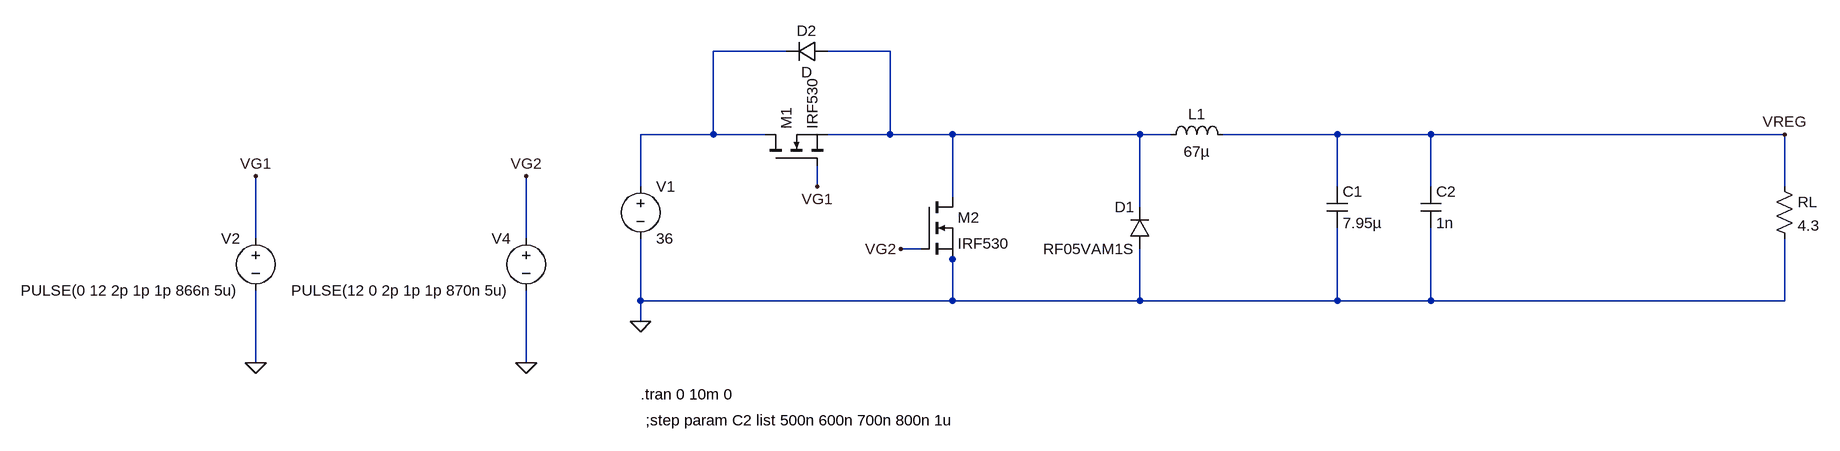
[diagram p0: schematic BUCK_v1.asc]
BUCK_v1.asc, the LTspice schematic file:
Version 4
SHEET 1 1644 692
WIRE 48 -80 -64 -80
WIRE 208 -80 112 -80
WIRE -64 48 -64 -80
WIRE -64 48 -176 48
WIRE 16 48 -64 48
WIRE 208 48 208 -80
WIRE 208 48 112 48
WIRE 304 48 208 48
WIRE 592 48 304 48
WIRE 640 48 592 48
WIRE 896 48 720 48
WIRE 1040 48 896 48
WIRE 1584 48 1040 48
WIRE -176 128 -176 48
WIRE 96 128 96 96
WIRE 896 128 896 48
WIRE 1040 128 1040 48
WIRE 1584 128 1584 48
WIRE 304 144 304 48
WIRE 592 160 592 48
WIRE -768 208 -768 112
WIRE -352 208 -352 112
WIRE 256 224 224 224
WIRE 304 240 304 224
WIRE -176 304 -176 208
WIRE 304 304 304 240
WIRE 304 304 -176 304
WIRE 592 304 592 224
WIRE 592 304 304 304
WIRE 896 304 896 192
WIRE 896 304 592 304
WIRE 1040 304 1040 192
WIRE 1040 304 896 304
WIRE 1584 304 1584 208
WIRE 1584 304 1040 304
WIRE -176 336 -176 304
WIRE -768 400 -768 288
WIRE -352 400 -352 288
FLAG -768 400 0
FLAG -176 336 0
FLAG -768 112 VG1
FLAG 96 128 VG1
FLAG 1584 48 VREG
FLAG -352 112 VG2
FLAG -352 400 0
FLAG 224 224 VG2
SYMBOL voltage -176 112 R0
WINDOW 123 0 0 Left 0
WINDOW 39 0 0 Left 0
SYMATTR InstName V1
SYMATTR Value 36
SYMBOL ind 624 64 R270
WINDOW 0 32 56 VTop 2
WINDOW 3 5 56 VBottom 2
SYMATTR InstName L1
SYMATTR Value 67µ
SYMBOL cap 880 128 R0
SYMATTR InstName C1
SYMATTR Value 7.95µ
SYMBOL nmos 16 96 R270
SYMATTR InstName M1
SYMATTR Value IRF530
SYMBOL voltage -768 192 M0
WINDOW 123 0 0 Left 0
WINDOW 39 0 0 Left 0
SYMATTR InstName V2
SYMATTR Value PULSE(0 12 2p 1p 1p 866n 5u)
SYMBOL voltage -352 192 M0
WINDOW 123 0 0 Left 0
WINDOW 39 0 0 Left 0
SYMATTR InstName V4
SYMATTR Value PULSE(12 0 2p 1p 1p 870n 5u)
SYMBOL nmos 256 144 R0
SYMATTR InstName M2
SYMATTR Value IRF530
SYMBOL cap 1024 128 R0
SYMATTR InstName C2
SYMATTR Value 1n
SYMBOL res 1568 112 R0
SYMATTR InstName RL
SYMATTR Value 4.3
SYMBOL diode 608 224 R180
WINDOW 0 24 64 Left 2
WINDOW 3 24 0 Left 2
SYMATTR InstName D1
SYMATTR Value RF05VAM1S
SYMBOL diode 112 -96 R90
WINDOW 0 0 32 VBottom 2
WINDOW 3 32 32 VTop 2
SYMATTR InstName D2
TEXT -176 448 Left 2 !.tran 0 10m 0
TEXT -168 488 Left 2 !;step param C2 list 500n 600n 700n 800n 1u

The netlist it stands for:
* BUCK_v1.asc
V1 N001 0 36
L1 N002 VREG 67µ
C1 VREG 0 7.95µ
M1 N001 VG1 N002 N002 IRF530
V2 VG1 0 PULSE(0 12 2p 1p 1p 866n 5u)
V4 VG2 0 PULSE(12 0 2p 1p 1p 870n 5u)
M2 N002 VG2 0 0 IRF530
C2 VREG 0 1n
RL VREG 0 4.3
D1 0 N002 RF05VAM1S
D2 N002 N001 D
.model D D
.lib standard.dio
.model NMOS NMOS
.model PMOS PMOS
.lib standard.mos
.tran 0 10m 0
;step param C2 list 500n 600n 700n 800n 1u
.backanno
.end